# EAGLE design Scarab v03 (EAGLE 7.2.0)
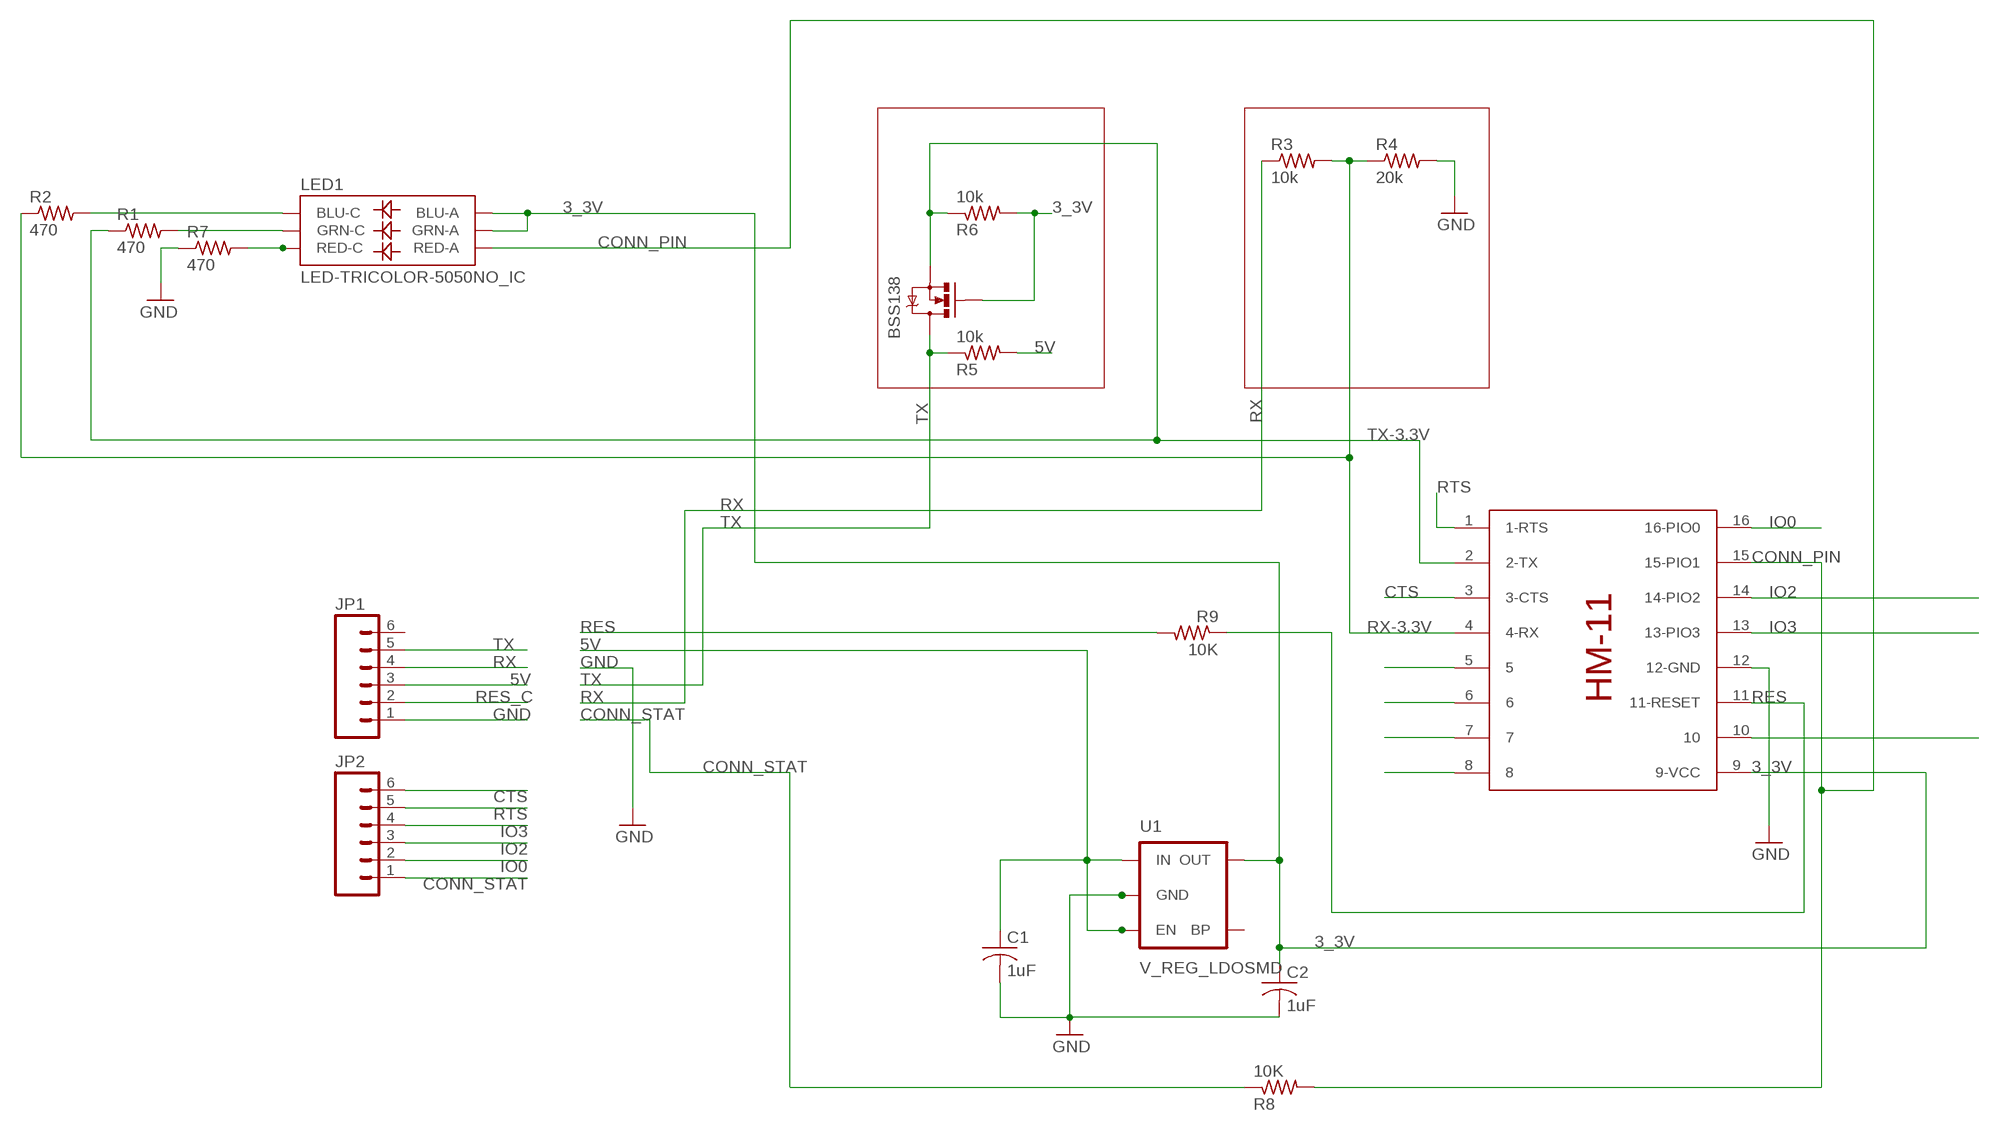
[diagram p0: schematic, sheet 1]

## Parts
BSS138  MOSFET-NCHANNELSMD  [SOT23-3]
C1  1uF  C-USC0402  [C0402]
C2  1uF  C-USC0402  [C0402]
JP1  M06LOCK  [1X06_LOCK]
JP2  M06LOCK  [1X06_LOCK]
LED1  LED-TRICOLOR-5050NO_IC  [LED-TRICOLOR-5050]
R1  470  R-US_R0402  [R0402]
R2  470  R-US_R0402  [R0402]
R3  10k  R-US_R0402  [R0402]
R4  20k  R-US_R0402  [R0402]
R5  10k  R-US_R0402  [R0402]
R6  10k  R-US_R0402  [R0402]
R7  470  R-US_R0402  [R0402]
R8  10K  R-US_R0402  [R0402]
R9  10K  R-US_R0402  [R0402]
U1  V_REG_LDOSMD  [SOT23-5]
U$1  HM-11  [HM-11]

## Nets
3_3V: BSS138.1(G) C2.1 LED1.1(GRN-A) LED1.3(BLU-A) R6.2 U1.5(OUT) U$1.9(9-VCC)
5V: C1.1 JP1.3 R5.2 U1.1(IN) U1.3(EN)
CONN_PIN: LED1.2(RED-A) R8.2 U$1.15(15-PIO1)
CONN_STAT: JP2.1 R8.1
CTS: JP2.6 U$1.3(3-CTS)
GND: C1.2 C2.2 JP1.1 R4.2 R7.1 U1.2(GND) U$1.12(12-GND)
IO0: JP2.2 U$1.16(16-PIO0)
IO2: JP2.3 U$1.14(14-PIO2)
IO3: JP2.4 U$1.13(13-PIO3)
N$2: LED1.6(GRN-C) R1.2
N$3: LED1.4(BLU-C) R2.2
N$4: U$1.10
N$10: U$1.5
N$11: U$1.6
N$14: U$1.7
N$15: U$1.8
N$26: LED1.5(RED-C) R7.2
RES: R9.1 U$1.11(11-RESET)
RES_C: JP1.2 R9.2
RTS: JP2.5 U$1.1(1-RTS)
RX: JP1.4 R3.1
RX-3.3V: R2.1 R3.2 R4.1 U$1.4(4-RX)
TX: BSS138.3(D) JP1.5 R5.1
TX-3.3V: BSS138.2(S) R1.1 R6.1 U$1.2(2-TX)
Unconnected: JP1.6 U1.4(BP)

## Library data of the parts
BSS138 = SparkFun:MOSFET-NCHANNEL
C1 C2 = resistor:C-US: CAPACITOR, American symbol
JP1 JP2 = SparkFun-Connectors:M06: Header 6 Standard 6-pin 0.1" header. Use with straight break away headers (SKU : PRT-00116), right angle break away headers (PRT-00553), swiss pins (PRT-00743), machine pins (PRT-00117), and female headers (PRT-00115). Molex polarized connector foot print use with SKU : PRT-08094 with associated crimp pins and housings. NOTES ON THE VARIANTS LOCK and LOCK_LONGPADS... This footprint was designed to help hold the alignment of a through-hole component (i.e. 6-pin header) while soldering it into place. You may notice that each hole has been shifted either up or down by 0.005 of an inch from it's more standard position (which is a perfectly straight line). This slight alteration caused the pins (the squares in the middle) to touch the edges of the holes. Because they are alternating, it causes a "brace" to hold the component in place. 0.005 has proven to be the perfect amount of "off-center" position when using our standard breakaway headers. Although looks a little odd when you look at the bare footprint, once you have a header in there, the alteration is very hard to notice. Also,if you push a header all the way into place, it is covered up entirely on the bottom side. This idea of altering the position of holes to aid alignment will be further integrated into the Sparkfun Library for other footprints. It can help hold any component with 3 or more connection pins.
LED1 = SparkFun-LED:LED-TRICOLOR-5050
R1-R9 = resistor:R-US_: RESISTOR, American symbol
U1 = SparkFun:V_REG_LDO: Voltage Regulator LDO Standard 150mA LDO voltage regulator in SOT-23 layout. Micrel part MIC5205. BP (by-pass) pin is used to lower output noise with 470pF cap.
U$1 = HM-11:HM-11

## Board
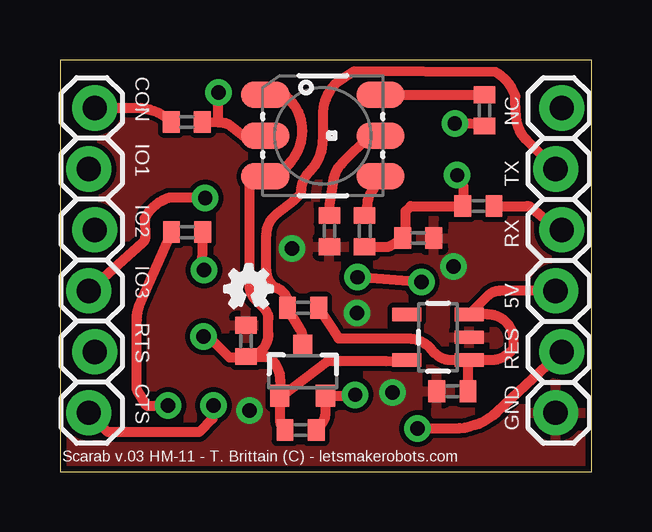
[diagram p1: board, top side]
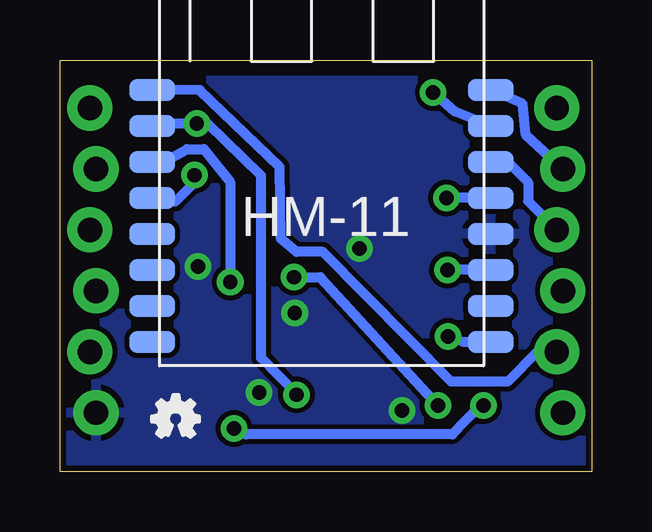
[diagram p2: board, bottom side, seen from below]

Size 22.15 x 17.15 mm. Coordinates in mm from the lower left corner, seen from the top.
Outline: 0,0 22.15,0 22.15,17.15 0,17.15 0,0
Copper layers (1*16): Top 0.035mm / dielectric 1.5mm / Bottom 0.035mm
Design rules "SparkFun (1)": minimum track width 8mil, minimum drill 20mil, track to track 8mil, track to pad 8mil, pad to pad 8mil, via to via 8mil, smd to smd 8mil, copper to edge 10mil, drill to drill 8mil, minimum pad ring 12mil, minimum via ring 10mil, stop-mask expansion 4mil, vias tented up to drill 25mil, thermal gap 10mil

### Footprints (pad centres in the part's own frame; a part is rotated, then mirrored left to right if it is on the bottom)
SOT23-3 = smd 0.8 x 0.9: 1 -0.95,-1; 2 0.95,-1; 3 0,1.1
C0402 = smd 0.7 x 0.9: 1 -0.65,0; 2 0.65,0
1X06_LOCK = drill 1.016 pad 1.88: 1 0,0; 2 2.54,-0.254; 3 5.08,0; 4 7.62,-0.254; 5 10.16,0; 6 12.7,-0.254
LED-TRICOLOR-5050 = smd 2 x 1.1: 1 -2.4,1.7; 2 -2.4,0; 3 -2.4,-1.7; 4 2.4,-1.7; 5 2.4,0; 6 2.4,1.7
R0402 = smd 0.7 x 0.9: 1 -0.65,0; 2 0.65,0
SOT23-5 = smd 0.55 x 1.2: 1 -0.95,-1.3; 2 0,-1.3; 3 0.95,-1.3; 4 0.95,1.3; 5 -0.95,1.3
HM-11 = smd 1.9 x 0.9: 1 -0.3,11.5; 2 -0.3,10; 3 -0.3,8.5; 4 -0.3,7; 5 -0.3,5.5; 6 -0.3,4; 7 -0.3,2.5; 8 -0.3,1; 9 13.8,1; 10 13.8,2.5; 11 13.8,4; 12 13.8,5.5; 13 13.8,7; 14 13.8,8.5; 15 13.8,10; 16 13.8,11.5

### Placement (x,y rotation side)
BSS138  10.11,4.16 0 top
C1  16.35,3.35 180 top
C2  7.75,5.44 90 top
JP1  20.65,2.45 90 top
JP2  1.45,15.15 270 top
LED1  10.95,14 0 top
R1  17.69,15.05 90 top
R2  12.7,10.02 90 top
R3  17.43,11.07 180 top
R4  14.93,9.73 0 top
R5  10.13,6.83 0 top
R6  10.02,1.73 180 top
R7  11.22,10.02 90 top
R8  5.28,14.57 0 top
R9  5.3,9.98 180 top
U1  15.75,5.6 90 top
U$1  18,4.4 0 bottom
U$3  [OSHW_FILLX70_NOTEXT]  18.32,1.42 0 bottom
U$4  [OSHW_FILLX70_NOTEXT]  6.87,6.84 0 top

### Tracks (layer width: path | path; a pad name or v marks a point on that pad's centre or on a via)
3_3V  (via drill 0.6)
  Top 0.406: BSS138.1 9.16,2.19 arc45 9.34,1.77 R6.2 | 9.13,3.13 BSS138.1 | v5.98,5.63 6,5.6 6.22,5.6 7.06,4.76 7.72,4.76 C2.1 | 8.03,12.15 LED1.3 9.1,12.3 9.65,12.96 arc40 10.1,14.2 arc49 9.46,15.61 9.35,15.7 LED1.1 | 8.03,12.15 7.85,12.1 | C2.1 8.58,4.79 arc-45 8.79,4.71 arc-45 9.17,3.79 BSS138.1 | C2.1 arc90 8.69,5.73 8.69,6.37 arc45 8.52,6.79 8.15,7.15 arc-45 7.9,7.76 7.9,12.02 8.03,12.15 | U1.5 14.43,4.63 13.59,4.61 11.15,4.61 9.25,3.14 BSS138.1
  Bottom 0.406: v5.98,5.63 5.34,5.4 U$1.9
5V
  Top 0.406: JP1.3 18.32,7.53 arc45 17.83,7.33 U1.3 17.82,6.55 arc-90 18.9,5.47 18.9,5.15 arc-55 17.94,4.65 U1.1 | C1.1 17,4.6 U1.1 | R5.2 11.61,5.55 11.8,5.55 14.49,5.55 arc-47 15.43,5.14 15.65,4.92 arc47 16.27,4.65 U1.1
CONN_PIN  (via drill 0.6)
  Top 0.406: R8.2 6.6,14.56 | 6.6,14.56 arc-26 7.04,14.46 7.7,13.95 8.5,13.95 LED1.2 | 6.6,14.56 6.6,15.72 v6.6,15.8
  Bottom 0.406: U$1.15 5.69,14.99 v6.6,15.8
CONN_STAT
  Top 0.406: JP2.1 3.23,15.15 arc-45 R8.1
CTS  (via drill 0.6)
  Top 0.406: v15.05,7.9 v12.4,8.1 | v6.4,2.75 6.35,2.2 5.8,1.65 2,1.65 JP2.6
  Bottom 0.406: U$1.3 17.8,12.9 16.85,13.44 16.15,13.44 15.06,12.06 v15.05,7.9 | v12.4,8.1 11.3,8.1 v6.4,2.75
GND  (via drill 0.6)
  other vias: 13.85,3.3 7.9,2.55 16.4,8.55 9.67,9.3 12.37,6.6
  pour Top: -1,16.3 -1,0 23.1,0 23.1,16.3
  pour Bottom: -1,16.3 -1,0 23.1,0 23.1,16.3
IO0
  Bottom 0.406: JP2.2 2.74,14.03 2.87,15.33 U$1.16
IO2
  Bottom 0.406: U$1.14 3.5,12.9 2.65,12.05 2.65,11.27 JP2.3
IO3  (via drill 0.6)
  Top 0.406: v6.05,11.4 4.52,11.4 arc45 3.52,10.54 3.55,9.76 arc-45 3.48,9.57 arc-3 3.42,9.53 JP2.4
  Bottom 0.406: U$1.13 v6.05,11.4
N$2
  Top 0.406: LED1.6 R1.2
N$3
  Top 0.406: LED1.4 12.9,12.3 13.06,11.74 arc45 12.81,11.15 R2.2
N$26
  Top 0.406: LED1.5 12.9,14 11.76,12.86 arc45 11.35,11.87 11.22,11.1 R7.2
RES  (via drill 0.6)
  Top 0.406: R9.1 5.9,8.69 arc42 v6,8.4
  Bottom 0.406: U$1.11 v6,8.4
RES_C  (via drill 0.6)
  Top 0.406: v4.5,2.75 3.6,2.75 3.2,3.4 3.2,6.32 arc-24 3.35,7.05 R9.2 | v14.9,1.8 16.44,1.8 arc43 18.22,2.5 JP1.2
  Bottom 0.406: v4.5,2.75 4.7,2.7 5.8,1.55 14.4,1.55 v14.9,1.8
RTS
  Bottom 0.406: JP2.5 2.26,4.99 3.5,3.75 5.85,3.75 11.2,9.15 12.3,9.15 12.95,9.7 13,12.7 16.32,15.89 U$1.1
RX
  Top 0.406: R3.1 19.45,11.07 arc-45 19.68,10.97 arc6 19.73,10.93 20.85,10.02 JP1.4
RX-3.3V  (via drill 0.6)
  Top 0.406: R2.1 13.71,9.38 R4.1 14.4,9.85 14.4,10.86 14.61,11.07 R3.2 16.82,11.1 16.82,11.87 16.55,12.14 v16.55,12.35
  Bottom 0.406: v16.55,12.35 16.6,12 17.35,11.25 18.15,11.25 U$1.4
TX
  Top 0.406: BSS138.3 10.11,5.57 arc31 10.01,5.93 R5.1 9.48,7.12 arc59 9.25,7.51 9.01,7.66 arc-59 8.6,8.37 8.6,9.86 arc-52 9.03,10.74 9.75,11.31 arc7 9.84,11.39 10.05,11.6 10.05,11.65 arc-45 10.4,12.5 arc45 10.95,13.82 10.95,14.84 arc-45 11.45,16.13 12.24,16.67 18.14,16.65 arc-45 18.97,15.63 19,14.87 arc45 19.43,13.83 JP1.5
TX-3.3V  (via drill 0.6)
  Top 0.406: R6.1 10.81,1.87 arc45 11.06,2.48 BSS138.2 12.26,3.16 v12.3,3.2 | R1.1 17.09,14.5 v16.45,14.5
  Bottom 0.406: U$1.2 18.2,14.3 18.3,14.25 17.9,14.5 v16.45,14.5 16.39,14.49 15.98,14.49 13.77,12.33 13.77,4.73 12.3,3.25 v12.3,3.2

### Text on the board
tNames: CON | NC | IO1 | TX | IO2 | RX | IO3 | 5V | RTS | RES | CTS | GND | Scarab v.03 HM-11 - T. Brittain (C) - letsmakerobots.com